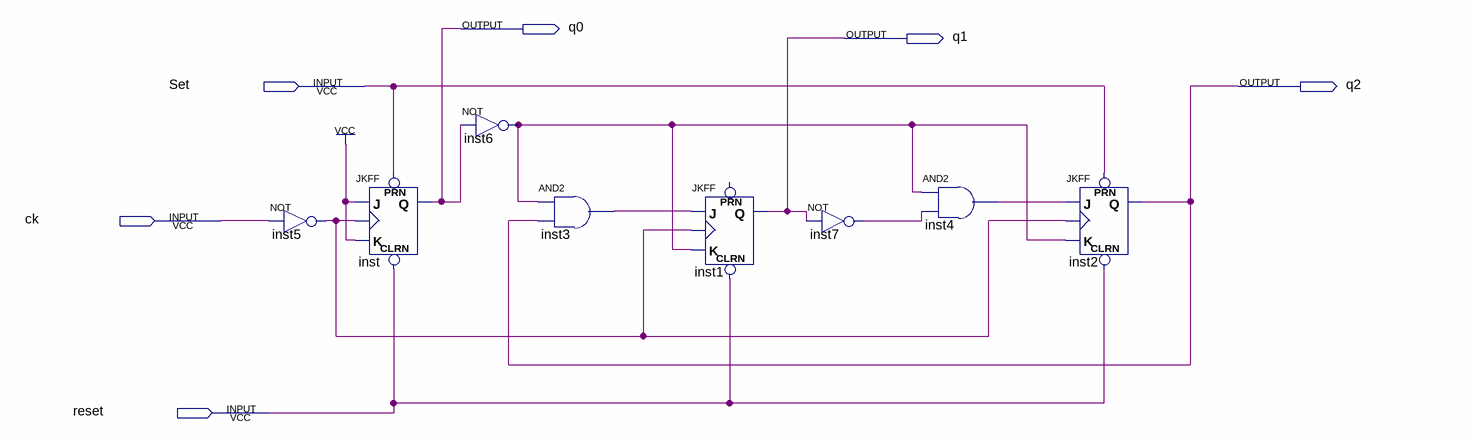
[diagram p0: schematic sheet]
// Quartus schematic num6invers.bdf as structural Verilog: 8 symbols, 6 pins
module num6invers (
  input  Set,
  input  ck,
  input  reset,
  output q0,
  output q1,
  output q2
);

  wire inst3_out, inst4_out, inst5_out, inst6_out, inst7_out;

  not inst5 (inst5_out, ck);
  JKFF inst (.PRN(Set), .CLRN(reset), .K(1'b1), .J(1'b1), .CLK(inst5_out), .Q(q0));
  not inst6 (inst6_out, q0);
  and inst3 (inst3_out, inst6_out, q2);
  JKFF inst1 (.CLRN(reset), .K(inst6_out), .J(inst3_out), .CLK(inst5_out), .Q(q1));  // open: PRN
  not inst7 (inst7_out, q1);
  and inst4 (inst4_out, inst6_out, inst7_out);
  JKFF inst2 (.PRN(Set), .CLRN(reset), .K(inst6_out), .J(inst4_out), .CLK(inst5_out), .Q(q2));
endmodule
